# Altium schematic sheet R2_Power_Board.SchDoc: R2_PowerBoard
size 558 x 279 mm; SheetNumber: 2; SheetTotal: 2
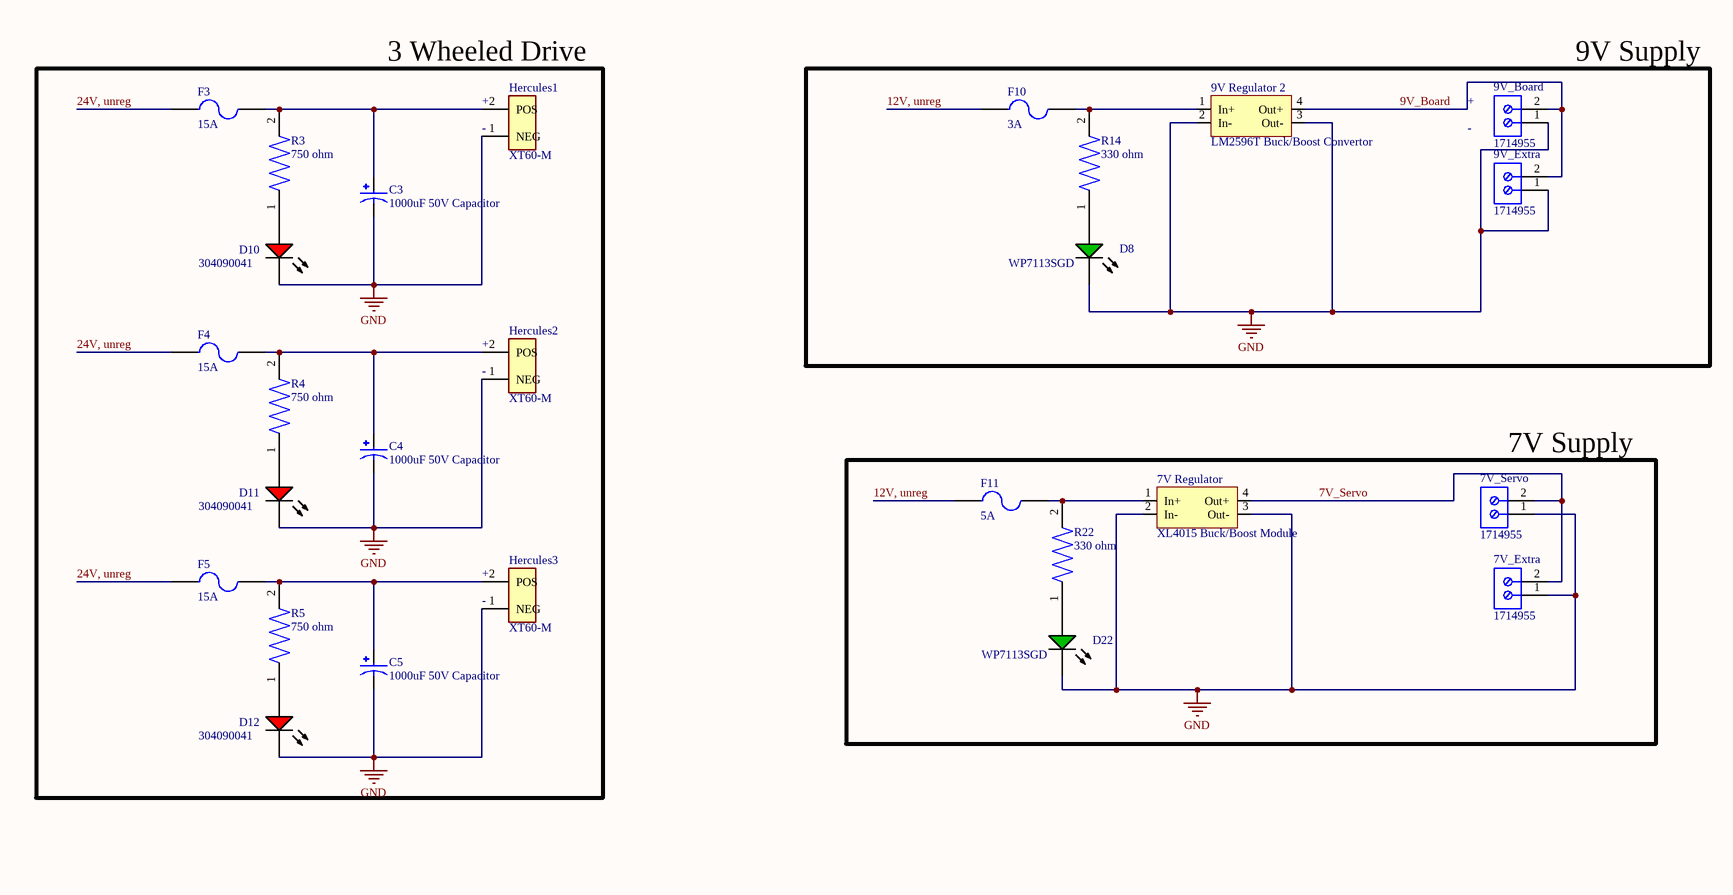
[diagram p0: R2_Power_Board.SchDoc, left]
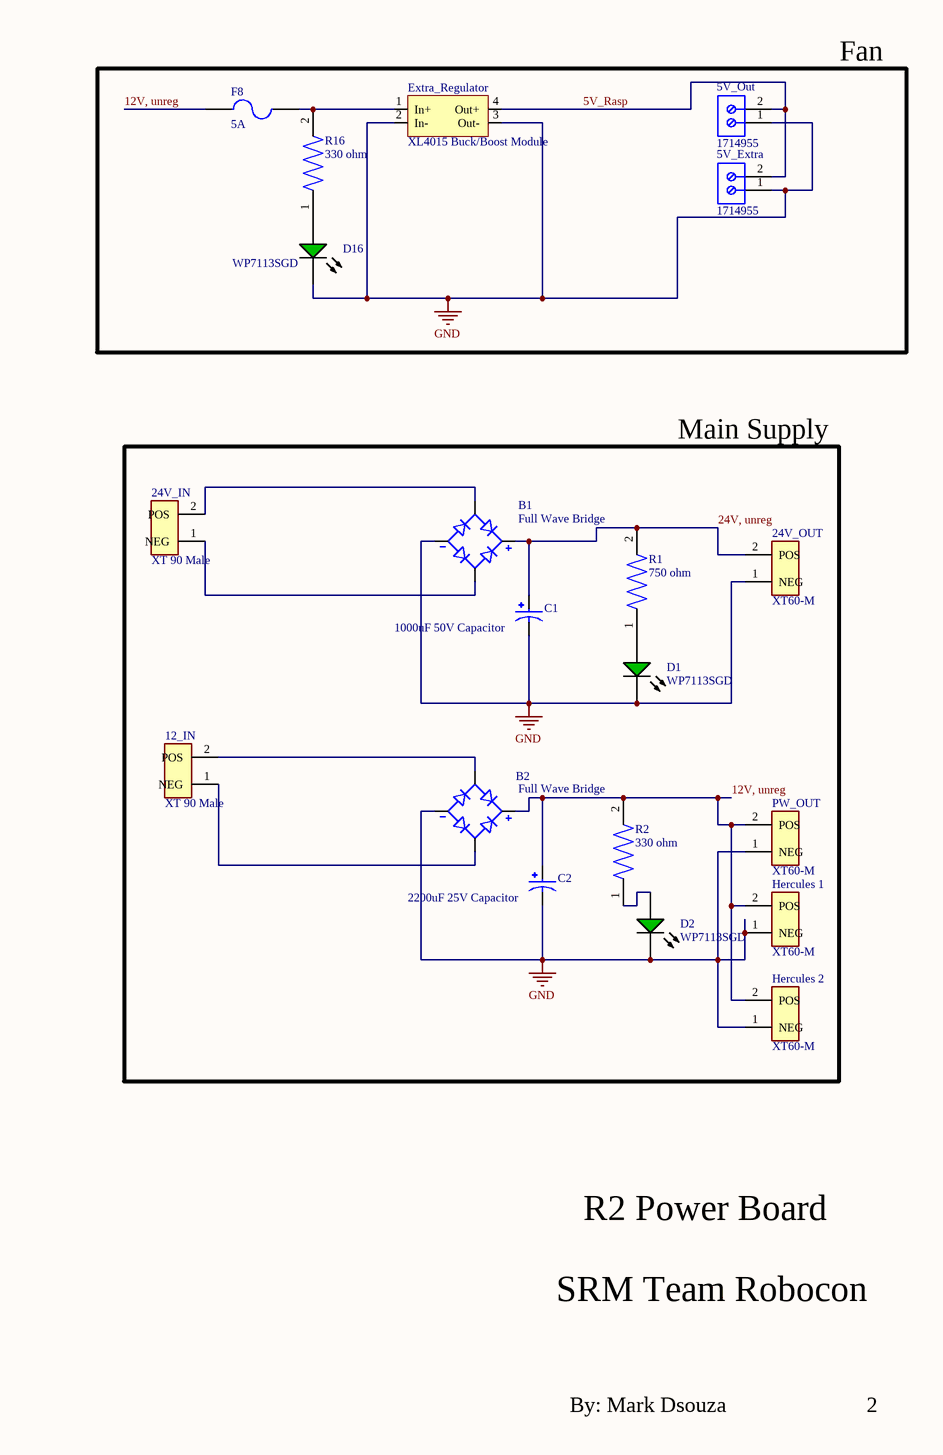
[diagram p1: R2_Power_Board.SchDoc, right]

## Parts
5V_Extra  1714955  [6.35mm 2 Way Screw Terminal]
5V_Out  1714955  [6.35mm 2 Way Screw Terminal]
7V_Extra  1714955  [6.35mm 2 Way Screw Terminal]
7V_Regulator  XL4015 Buck/Boost Module  [XL4014 Module]
7V_Servo  1714955  [6.35mm 2 Way Screw Terminal]
9V_Board  1714955  [6.35mm 2 Way Screw Terminal]
9V_Extra  1714955  [6.35mm 2 Way Screw Terminal]
9V_Regulator_2  LM2596T Buck/Boost Convertor  [LM2596 MODULE]
12_IN  XT 90 Male  [XT 90-M]
24V_IN  XT 90 Male  [XT 90-M]
24V_OUT  XT60-M  [AMASS_XT60-M]
B1  Full Wave Bridge  [Full Wave Bridge]
B2  Full Wave Bridge  [Full Wave Bridge]
C1  1000uF 50V Capacitor  [1000uF 50V Capacitor]
C2  2200uF 25V Capacitor  [2200uF 25V Capacitor]
C3  1000uF 50V Capacitor  [1000uF 50V Capacitor]
C4  1000uF 50V Capacitor  [1000uF 50V Capacitor]
C5  1000uF 50V Capacitor  [1000uF 50V Capacitor]
D1  WP7113SGD  [KING-WP7113SGD_V]
D2  WP7113SGD  [KING-WP7113SGD_V]
D8  WP7113SGD  [KING-WP7113SGD_V]
D10  304090041  [LED-2P-2.28-3MM_A]
D11  304090041  [LED-2P-2.28-3MM_A]
D12  304090041  [LED-2P-2.28-3MM_A]
D16  WP7113SGD  [KING-WP7113SGD_V]
D22  WP7113SGD  [KING-WP7113SGD_V]
Extra_Regulator  XL4015 Buck/Boost Module  [XL4014 Module]
F3  15A  [FUSE]
F4  15A  [FUSE]
F5  15A  [FUSE]
F8  5A  [Fuse_small]
F10  3A  [Fuse_small]
F11  5A  [Fuse_small]
Hercules1  XT60-M  [AMASS_XT60-M]
Hercules2  XT60-M  [AMASS_XT60-M]
Hercules3  XT60-M  [AMASS_XT60-M]
Hercules_1  XT60-M  [AMASS_XT60-M]
Hercules_2  XT60-M  [AMASS_XT60-M]
PW_OUT  XT60-M  [AMASS_XT60-M]
R1  750 ohm  [TH Resistor]
R2  330 ohm  [TH Resistor]
R3  750 ohm  [TH Resistor]
R4  750 ohm  [TH Resistor]
R5  750 ohm  [TH Resistor]
R14  330 ohm  [TH Resistor]
R16  330 ohm  [TH Resistor]
R22  330 ohm  [TH Resistor]

## Blocks framed on the sheet
3 Wheeled Drive: C3-C5 D10-D12 F3-F5 Hercules1-Hercules3 R3-R5
9V Supply: 9V_Board 9V_Extra 9V_Regulator_2 D8 F10 R14
Fan: 5V_Extra 5V_Out D16 Extra_Regulator F8 R16
7V Supply: 7V_Extra 7V_Regulator 7V_Servo D22 F11 R22
Main Supply: 12_IN 24V_IN 24V_OUT B1 B2 C1 C2 D1 D2 Hercules_1 Hercules_2 PW_OUT R1 R2

## Nets
GND: 5V_Extra.1 5V_Out.1 7V_Extra.1 7V_Regulator.2(In-) 7V_Regulator.3(Out-) 7V_Servo.1 9V_Board.1 9V_Extra.1 9V_Regulator_2.2(In-) 9V_Regulator_2.3(Out-) 24V_OUT.1(NEG) B1.N B2.N C1.N C2.N C3.N C4.N C5.N D1.2(K) D2.2(K) D8.2(K) D10.2(K) D11.2(K) D12.2(K) D16.2(K) D22.2(K) Extra_Regulator.2(In-) Extra_Regulator.3(Out-) Hercules1.1(NEG) Hercules2.1(NEG) Hercules3.1(NEG) Hercules_1.1(NEG) Hercules_2.1(NEG) PW_OUT.1(NEG)
5V_Rasp: 5V_Extra.2 5V_Out.2 Extra_Regulator.4(Out+)
7V_Servo: 7V_Extra.2 7V_Regulator.4(Out+) 7V_Servo.2
9V_Board: 9V_Board.2 9V_Extra.2 9V_Regulator_2.4(Out+)
12V, unreg: B2.P C2.P F8.1 F10.1 F11.1 Hercules_1.2(POS) Hercules_2.2(POS) PW_OUT.2(POS) R2.2
24V, unreg: 24V_OUT.2(POS) B1.P C1.P F3.1 F4.1 F5.1 R1.2
Net7V_Regulator_1: 7V_Regulator.1(In+) F11.2 R22.2
Net9V_Regulator_2_1: 9V_Regulator_2.1(In+) F10.2 R14.2
Net12_IN_1: 12_IN.1(NEG) B2.AC1
Net12_IN_2: 12_IN.2(POS) B2.AC2
Net24V_IN_1: 24V_IN.1(NEG) B1.AC1
Net24V_IN_2: 24V_IN.2(POS) B1.AC2
NetC3_P: C3.P F3.2 Hercules1.2(POS) R3.2
NetC4_P: C4.P F4.2 Hercules2.2(POS) R4.2
NetC5_P: C5.P F5.2 Hercules3.2(POS) R5.2
NetD1_1: D1.1(A) R1.1
NetD2_1: D2.1(A) R2.1
NetD8_1: D8.1(A) R14.1
NetD10_1: D10.1(A) R3.1
NetD11_1: D11.1(A) R4.1
NetD12_1: D12.1(A) R5.1
NetD16_1: D16.1(A) R16.1
NetD22_1: D22.1(A) R22.1
NetExtra_Regulator_1: Extra_Regulator.1(In+) F8.2 R16.2

## Notes on the sheet
- (near Hercules1) +
- (near 9V_Board) +
- (near Hercules1) -
- -
- (near Hercules2) +
- (near Hercules2) -
- (near Hercules3) +
- (near Hercules3) -
- R2 Power Board
- SRM Team Robocon
- By: Mark Dsouza
- 2

## Library data of the parts
5V_Extra 5V_Out 7V_Extra 7V_Servo 9V_Board 9V_Extra = 6.35mm 2 Way Screw Terminal: PC Terminal Block, Pitch 6.35 mm, 1 x 2 Position, Height 21.5 mm, Tail Lenght 5.1 mm, RoHS, Bulk; Manufacturer: Phoenix Contact; Package Description: PC Terminal Block, Pitch 6.35 mm, 1 x 2 Position, Height 21.5 mm, Tail Lenght 5.1 mm; Datasheet URL: http://media.digikey.com/pdf/Data%20Sheets/Phoenix%20Contact%20PDFs/1714955.pdf; Package Reference: 1714955; Manufacturer URL: http://www.phoenixcontact.com/; Datasheet Version: 02/2010; Mounting Technology: ThroughHole
24V_OUT Hercules1-Hercules3 Hercules_1 Hercules_2 PW_OUT = XT60-M: Plug; DC supply; XT60; male; PIN: 2; for cable; soldered; 30A; 500V; MF: AMASS; MP: XT60-M; Price: None; Package: Package Analog Devices; Value: *; Availability: Unavailable; SnapEDA_Link: https://www.snapeda.com/parts/XT60-M/AMASS/view-part/2883912/?ref=snap
B1 B2 = Full Wave Bridge: Full Wave Diode Bridge; Published: 8-Jun-2000; LatestRevisionDate: 29-May-2009; LatestRevisionNote: Sch pins A & K swapped.; DatasheetVersion: E2732B; PackageReference: D-38; Publisher: Altium Limited; PackageDescription: Bridge Rectifier; 4 Terminals; Body 9.4 x 9.4 mm (typ); Pitch 5.08 mm
C1 C3-C5 = 1000uF 50V Capacitor: CAP ALUM 1000UF 20% 50V RADIAL; MF: Panasonic; MP: EEU-HD1H102B; Availability: In Stock; Check_prices: https://www.snapeda.com/parts/EEU-HD1H102B/Panasonic/view-part/2335470/?ref=eda; Package: RADIAL-2 Panasonic; Price: None; SnapEDA_Link: https://www.snapeda.com/parts/EEU-HD1H102B/Panasonic/view-part/2335470/?ref=snap; Value: *
C2 = 2200uF 25V Capacitor: Aluminum Electrolytic Capacitors, TA-A Series, 2200uF +/- 20%, 25V, Radial lead type(16x31.5mm); MF: Panasonic; MP: EEUTA1E222; Package: RADIAL-2 Panasonic; Purchase-URL: https://pricing.snapeda.com/search/part/EEUTA1E222/?ref=eda; Value: *; Availability: In Stock; SnapEDA_Link: https://www.snapeda.com/parts/EEUTA1E222/Panasonic/view-part/5784153/?ref=snap; Price: None; Check_prices: https://www.snapeda.com/parts/EEUTA1E222/Panasonic/view-part/5784153/?ref=eda
D1 D2 D8 D16 D22 = CMP-007-00010-1: LED Green, 62.5 mW, 25 mA, -40 to 85 degC, 2-Pin THD, RoHS, Bulk; Manufacturer: Kingbright; Viewing Angle: 30degrees; Forward Voltage: 2.2V; Lens Style: Dome; Power: 62.5mW; Luminous Intensity: 40mcd; Illumination Colour: Green; Datasheet Version: Rev. 6B, 01/2015; Colour: Green; Mounting Technology: TH; Nominal Vf: 2.2V; Package Description: 2-Pin Through Hole Device, Dia 5.9 mm, Body Length 8.6 mm; Package Quantity: 1000; Case/Package: Radial; RoHS Compliant: True; Packaging: Bulk; Package Reference: WP7113SGD; Datasheet URL: http://www.kingbrightusa.com/images/catalog/SPEC/WP7113SGD.pdf
D10-D12 = CMP-007-00007-1: Red LED, 80 mW, 30 mA, -25 to 85 degC, 2-Pin THD; Manufacturer: Shenzhen CGX; Datasheet URL: http://datasheet.octopart.com/304090041-Chengguangxing-datasheet-62330656.pdf; Package Description: 2-Pin Through Hole Device, Dia 3 mm, Pitch 2.28 mm; Manufacturer URL: http://szcgx.com/; RoHS Compliant: Unknown; Case/Package: 304090041; Package Reference: 304090041; Datasheet Version: Sep-14; Mounting Technology: TH
F3-F5 = Fuse
F8 F10 F11 = Fuse _small
R1-R5 R14 R16 R22 = TH Resistor: 1 MOhms Â±5% 0.25W, 1/4W Through Hole Resistor Axial - Carbon Film; MF: TE Connectivity; MP: 3-1623927-1; Price: None; SnapEDA_Link: https://www.snapeda.com/parts/3-1623927-1/TE+Connectivity/view-part/?ref=snap; Check_prices: https://www.snapeda.com/parts/3-1623927-1/TE+Connectivity/view-part/?ref=eda; Value: *; Package: None; Availability: In Stock